# EasyEDA Pro project Generic_Robot_Controller_ver2.epro

# Board PCB2
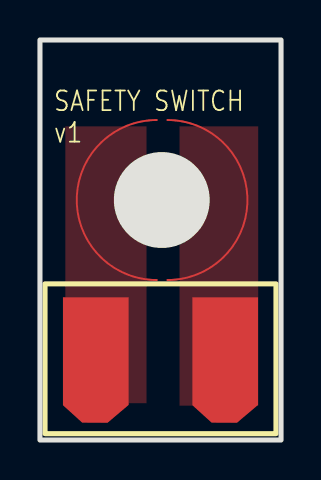
[diagram p0: board, top side]
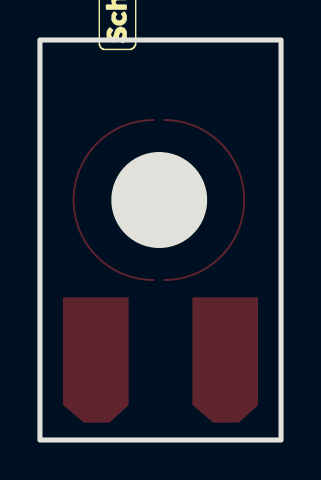
[diagram p1: board, bottom side, seen from below]

Outline 12.06 x 20 mm; copper layers: Top Layer, Bottom Layer. Coordinates in mm from the lower left corner of the outline.
Outline path: rectangle 0,20 12.06,0
Stack: Top Layer 0.035mm / Dielectric1 1.51mm FR4 er 4.5 / Bottom Layer 0.035mm

## Design rules (mm)
template: JLCPCB Capability(Two Layers Board)
spacing copperThickness1oz (default): track to track 0.102, other pairs 0.152 to 0.3
spacing copperThickness2oz: track to track 0.203, other pairs 0.152 to 0.3
track width copperThickness1oz (default): min 0.127, default 0.254, max 2.54
track width copperThickness2oz: min 0.203, default 0.254, max 2.54
differential pair differentialPair (default): width min 0.127, default 0.254, max 2.54; gap min 0.152, default 0.152
via viaSize (default): diameter min 0.5, default 0.61, max 10; hole min 0.3, default 0.305, max 6.3

## Placement (name value [footprint] x y rotation side)
U1  -  [Battery Solder Pad]  6.1 0.82 0 top
U2  -  [screw_switch]  6.1 12 0 top

## Footprints (pads in the part's own frame, mm; a bottom-side part is the same pattern mirrored in y, then rotated)
Battery Solder Pad
  custom 3.286x6.269 smd: 1(-3.302,3.175) 2(3.175,3.175)
screw_switch
  custom 4x8 smd: 1(-2.254,0) 2(2.286,0)

## Nets
$1N152: U1.1 U2.1
$1N166: U1.2 U2.2

## Copper pours and planes (outline as drawn; the poured copper is in the pictures)
$1N152 on Top Layer: 1.27,15.68 5.33,15.68 5.33,1.84 1.27,1.84
$1N166 on Top Layer: 6.99,15.68 10.92,15.68 10.92,1.71 6.99,1.71

## Text on the board
Top Silkscreen Layer: SAFETY SWITCH / v1

# Board PCB1_1
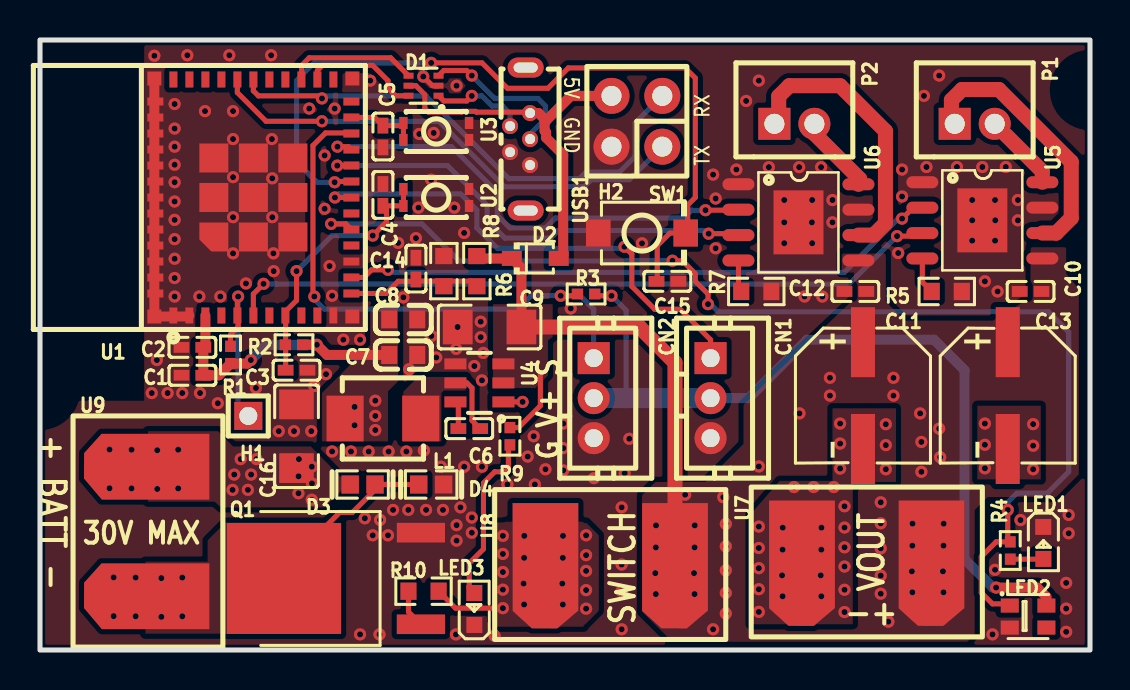
[diagram p2: board, top side]
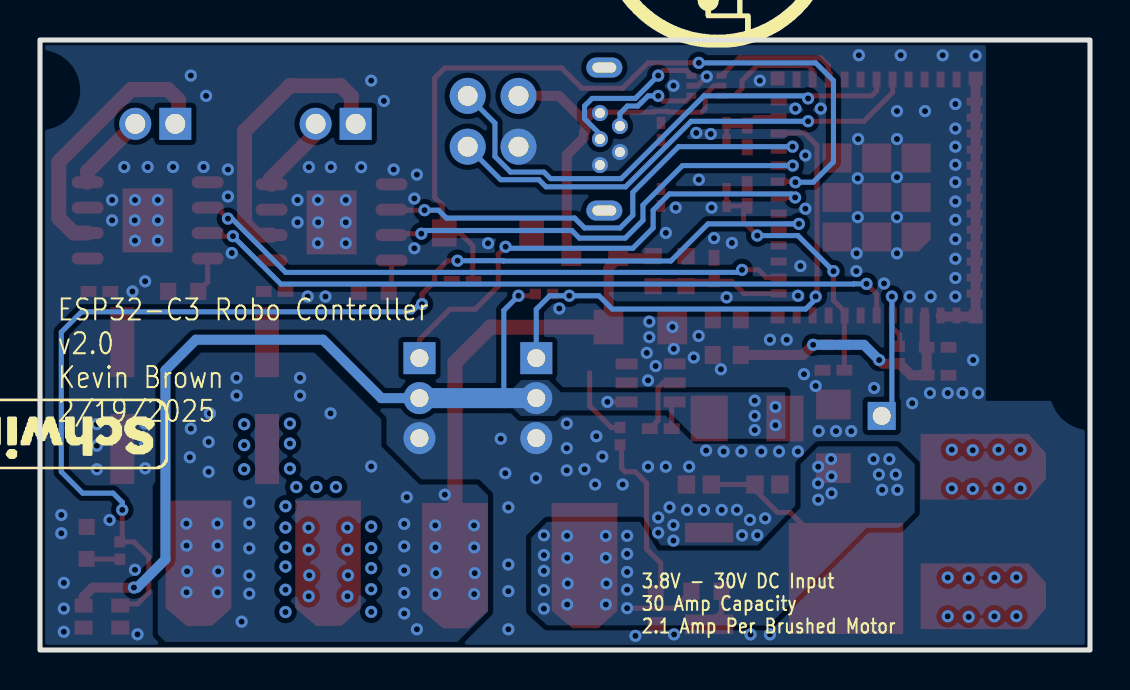
[diagram p3: board, bottom side, seen from below]

Outline 52.5 x 30.5 mm; copper layers: Top Layer, Inner1, Inner2, Bottom Layer. Coordinates in mm from the lower left corner of the outline.
Outline path: rectangle 0,30.5 52.5,0
Stack: Top Layer 0.035mm Outer layer thickness 1oz / Dielectric1 0.2104mm 7628 RC49% 8.6mil / Inner1 0.0152mm Inner layer thickness / Dielectric2 1.065mm 1.1mm H/HOZ Copper / Inner2 0.0152mm Inner layer thickness / Dielectric3 0.2104mm 7628 RC49% 8.6mil / Bottom Layer 0.035mm Outer layer thickness 1oz

## Design rules (mm)
template: Custom Config
spacing copperThickness1oz (default): track to track 0.102, other pairs 0.152 to 0.3
spacing copperThickness2oz: track to track 0.203, other pairs 0.152 to 0.3
track width copperThickness1oz (default): min 0.127, default 0.254, max 2.54
track width copperThickness2oz: min 0.203, default 0.254, max 2.54
differential pair differentialPair (default): width min 0.127, default 0.254, max 2.54; gap min 0.152, default 0.152
via viaSize (default): diameter min 0.5, default 0.61, max 10; hole min 0.3, default 0.305, max 6.3
net GND uses copperRegionDirect
net V_IN uses copperRegionDirect

## Placement (name value [footprint] x y rotation side)
C1  10uF  [C0402]  7.62 13.74 0 top
C2  100nF  [C0402]  7.62 15.13 0 top
C3  1uF  [C0402]  12.83 13.99 180 top
C4  100nF  [C0402]  17.15 22.75 270 top
C5  100nF  [C0402]  17.15 25.67 90 top
C6  100nF  [C0402]  21.46 11.07 180 top
C7  22uF  [C0603]  18.16 14.75 180 top
C8  22uF  [C0603]  18.16 16.53 180 top
C9  10uF  [C1206]  22.48 16.15 0 top
C10  100nF  [C0402]  49.53 17.93 0 top
C11  33uF  [CAP-SMD_BD6.3-L6.6-W6.6-FD]  41.15 12.72 270 top
C12  100nF  [C0402]  40.77 17.93 0 top
C13  33uF  [CAP-SMD_BD6.3-L6.6-W6.6-FD]  48.39 12.72 270 top
C14  47nF  [C0402]  18.8 19.07 270 top
C15  1uF  [C0402]  31.37 18.44 180 top
C16  10uF  [C1206]  12.83 10.69 270 top
CN1  SERVO1  [CONN-TH_3P-P2.00_PH-3AK]  33.53 12.59 270 top
CN2  SERVO2  [CONN-TH_3P-P2.00_PH-3AK]  27.69 12.59 270 top
D1  USBLC6-2P6_C2827693  [SOT-666-6_L1.6-W1.2-P0.50-LS1.6-BL]  19.18 28.21 90 top
D2  B5819WS_C22624  [SOD-323_L1.8-W1.3-LS2.5-RD]  24.76 19.58 0 top
D3  ESDA05  [D0603-BI]  16.13 8.28 180 top
D4  ESDA05  [D0603-BI]  19.56 8.28 180 top
H1  -  [HDR-TH_1P-V-M_XKB_X4611WV-01I-C28D40]  10.41 11.7 0 top
H2  -  [HDR-TH_4P-P2.54-V-F-R2-C2-S2.54]  29.84 26.44 90 top
L1  4.7uH  [IND-SMD_L4.5-W4.1_IHLP]  17.15 11.58 180 top
LED1  NCD0603B1  [LED0603-RD]  50.16 5.35 270 top
LED2  WS2812C-2020-V1  [LED-SMD_4P-L2.0-W2.0-TL_WS2812B-2020]  49.4 1.67 0 top
LED3  NCD0603G1  [LED0603-RD]  21.72 2.05 90 top
P1  MOTOR1  [CONN-TH_2P-P2.00_PH-2A_C2319]  46.74 26.31 180 top
P2  MOTOR2  [CONN-TH_2P-P2.00_PH-2A_C2319]  37.72 26.31 180 top
Q1  IRLR8726TRPBF  [TO-252-2_L6.6-W6.1-P4.58-LS9.9-TL]  15.62 3.58 180 top
R1  10kΩ  [R0402]  9.53 14.75 270 top
R2  10kΩ  [R0402]  12.7 15.26 0 top
R3  10kΩ  [R0402]  27.31 17.8 180 top
R4  1kΩ  [R0402]  48.51 4.97 90 top
R5  30kΩ  [R0603]  45.34 17.93 180 top
R6  27kΩ  [R0603]  21.84 18.94 90 top
R7  30kΩ  [R0603]  35.81 17.93 180 top
R8  3kΩ  [R0603]  20.19 18.94 270 top
R9  5.1kΩ  [R0402]  23.5 10.69 90 top
R10  10kΩ  [R0603]  19.18 2.94 180 top
SW1  TS-1088-AR02016  [SW-SMD_L3.9-W3.0-P4.45]  30.1 20.85 0 top
U1  2.4GHz  [WIFIM-SMD_ESP32-C3-MINI-1]  10.67 22.63 90 top
U2  RESET  [SW-SMD_4P-L3.0-W2.0-P0.85-LS3.5]  19.81 22.63 0 top
U3  BOOT  [SW-SMD_4P-L3.0-W2.0-P0.85-LS3.5]  19.81 25.93 0 top
U4  AP63203WU-7  [TSOT-26_L2.9-W1.6-P0.95-LS2.8-BL]  21.97 13.36 90 top
U5  DRV8871DDAR  [SO-8_L4.9-W3.9-P1.27-LS6.0-BL-EP]  47.12 21.48 270 top
U6  DRV8871DDAR  [SO-8_L4.9-W3.9-P1.27-LS6.0-BL-EP]  37.92 21.38 270 top
U7  -  [Battery Solder Pad]  41.4 1.16 0 top
U8  -  [Battery Solder Pad]  28.57 1.04 0 top
U9  -  [Battery Solder Pad]  2.16 5.86 270 top
USB1  MICRO 180°JB  [MINI-USB-SMD_U255-051N-4BH70-XS]  24 25.55 90 top

## Footprints (pads in the part's own frame, mm; a bottom-side part is the same pattern mirrored in y, then rotated)
Battery Solder Pad
  custom 3.286x6.269 smd: 1(-3.302,3.175) 2(3.175,3.175)
C0402
  rect 0.79x0.54 smd: 1(-0.545,0) 2(0.545,0)
C0603
  rect 0.8x0.9 smd: 1(-0.7,0) 2(0.7,0)
C1206
  rect 1.485x1.728 smd: 1(-1.593,0) 2(1.593,0)
CAP-SMD_BD6.3-L6.6-W6.6-FD
  rect 3.5x1.2 smd: 1(-2.67,0) 2(2.67,0)
CONN-TH_2P-P2.00_PH-2A_C2319
  rect 1.6x1.6 hole 1: 1(1,0)
  round 1.6 hole 1: 2(-1,0)
CONN-TH_3P-P2.00_PH-3AK
  rect 1.6x1.6 hole 0.9: 1(-2,0)
  round 1.6 hole 0.9: 2(0,0) 3(2,0)
D0603-BI
  rect 0.873x0.907 smd: 1(-0.622,0) 2(0.622,0)
HDR-TH_1P-V-M_XKB_X4611WV-01I-C28D40
  rect 1.4x1.4 hole 0.9: 1(0,0)
HDR-TH_4P-P2.54-V-F-R2-C2-S2.54
  round 1.8 hole 1: 1(-1.27,-1.27) 2(-1.27,1.27) 3(1.27,-1.27) 4(1.27,1.27)
IND-SMD_L4.5-W4.1_IHLP
  rect 1.855x2.286 smd: 1(-1.893,0) 2(1.893,0)
LED0603-RD
  rect 0.8x0.8 smd: 1(-0.799,-0.004) 2(0.799,0.004)
LED-SMD_4P-L2.0-W2.0-TL_WS2812B-2020
  rect 0.9x0.7 smd: 1(-0.915,0.55) 2(-0.915,-0.55) 3(0.915,-0.55) 4(0.915,0.55)
MINI-USB-SMD_U255-051N-4BH70-XS
  round 0.8 hole 0.5: 1(1.3,-0.5) 2(0.65,0.5) 3(0,-0.5) 4(-0.65,0.5) 5(-1.3,-0.5)
  oval 1x1.8 hole 0.5x1.2: 6(-3.575,-0.28) 6(3.575,-0.28)
R0402
  rect 0.566x0.54 smd: 1(-0.433,0) 2(0.433,0)
R0603
  rect 0.806x0.864 smd: 1(-0.753,0) 2(0.753,0)
SO-8_L4.9-W3.9-P1.27-LS6.0-BL-EP
  oval 0.6x1.6 smd: 1(-1.905,-3) 2(-0.635,-3) 3(0.635,-3) 4(1.905,-3) 5(1.905,3) 6(0.635,3) 7(-0.635,3) 8(-1.905,3)
  rect 3.2x2.5 smd: 9(0,0)
SOD-323_L1.8-W1.3-LS2.5-RD
  rect 1x0.75 smd: 1(-1.173,0) 2(1.173,0)
SOT-666-6_L1.6-W1.2-P0.50-LS1.6-BL
  rect 0.3x0.5 smd: 1(-0.5,-0.75) 2(-0.001,-0.75) 3(0.5,-0.75) 4(0.5,0.75) 5(0,0.75) 6(-0.5,0.75)
SW-SMD_4P-L3.0-W2.0-P0.85-LS3.5
  rect 0.42x0.6 smd: 1(-1.64,0.425) 1(-1.64,-0.425) 2(1.64,0.425) 2(1.64,-0.425)
SW-SMD_L3.9-W3.0-P4.45
  rect 1.23x1.36 smd: 1(-2.185,0) 2(2.185,0)
TO-252-2_L6.6-W6.1-P4.58-LS9.9-TL
  rect 2.409x0.979 smd: 1(-3.424,2.29) 3(-3.424,-2.29)
  rect 5.711x5.548 smd: 2(3.424,0)
TSOT-26_L2.9-W1.6-P0.95-LS2.8-BL
  rect 0.55x1.1 smd: 1(-0.95,-1.2) 2(0,-1.2) 3(0.95,-1.2) 4(0.95,1.2) 5(0,1.2) 6(-0.95,1.2)
WIFIM-SMD_ESP32-C3-MINI-1
  rect 0.8x0.4 smd: 1(-5.9,4) 2(-5.9,3.2) 3(-5.9,2.4) 4(-5.9,1.6) 5(-5.9,0.8) 6(-5.9,0) 7(-5.9,-0.8) 8(-5.9,-1.6) 9(-5.9,-2.4) 10(-5.9,-3.2) 11(-5.9,-4) 25(5.9,-4) 26(5.9,-3.2) 27(5.9,-2.4) 28(5.9,-1.6) 29(5.9,-0.8) 30(5.9,0) 31(5.9,0.8) 32(5.9,1.6) 33(5.9,2.4) 34(5.9,3.2) 35(5.9,4)
  rect 0.4x0.8 smd: 12(-4.8,-4.9) 13(-4,-4.9) 14(-3.2,-4.9) 15(-2.4,-4.9) 16(-1.6,-4.9) 17(-0.8,-4.9) 18(0,-4.9) 19(0.8,-4.9) 20(1.6,-4.9) 21(2.4,-4.9) 22(3.2,-4.9) 23(4,-4.9) 24(4.8,-4.9) 36(4.8,4.9) 37(4,4.9) 38(3.2,4.9) 39(2.4,4.9) 40(1.6,4.9) 41(0.8,4.9) 42(0,4.9) 43(-0.8,4.9) 44(-1.6,4.9) 45(-2.4,4.9) 46(-3.2,4.9) 47(-4,4.9) 48(-4.8,4.9)
  custom 1.45x1.45 smd: 49(-1.975,1.975)
  rect 1.45x1.45 smd: 49(-1.975,0) 49(-1.975,-1.975) 49(0,1.975) 49(0,0) 49(0,-1.975) 49(1.975,1.975) 49(1.975,0) 49(1.975,-1.975)
  rect 0.7x0.7 smd: 50(5.95,4.95) 51(5.95,-4.95) 52(-5.95,-4.95) 53(-5.95,4.95)

## Nets
3V3: C1.2 C2.2 C7.2 C8.2 CN1.2 CN2.2 L1.2 LED2.4 R1.2 R2.2 R3.1 U1.3 U4.1
GND: C1.1 C2.1 C3.1 C4.1 C5.1 C7.1 C8.1 C9.1 C10.1 C11.2 C12.1 C13.2 C14.1 C15.1 C16.1 CN1.3 CN2.3 D1.2 D4.1 H2.2 LED1.1 LED2.2 LED3.1 Q1.3 R5.1 R7.1 R8.1 SW1.1 U1.1 U1.2 U1.11 U1.14 U1.36 U1.37 U1.38 U1.39 U1.40 U1.41 U1.42 U1.43 U1.44 U1.45 U1.46 U1.47 U1.48 U1.49 U1.50 U1.51 U1.52 U1.53 U2.2 U3.2 U4.4 U5.1 U5.7 U5.9 U6.1 U6.7 U6.9 U7.1 USB1.4 USB1.5
BATT_GND: D3.1 D4.2 Q1.2 U9.2
BATT_IN: C16.2 D3.2 R10.1 U8.1 U9.1
BATT_MEAS: C14.2 R6.1 R8.2 U1.12
BOOT: C5.2 U1.23 U3.1
DEBUG_LED: LED2.1 R4.2 U1.16
DN: D1.6 U1.26
DN_IN: D1.1 USB1.2
DP: D1.4 U1.27
DP_IN: D1.3 USB1.3
MODE_BUTTON: C15.2 SW1.2 U1.19
MOTOR1_IN1: U1.6 U5.3
MOTOR1_IN2: U1.13 U5.2
MOTOR1_OUT1: P1.1 U5.6
MOTOR1_OUT2: P1.2 U5.8
MOTOR2_IN1: U1.20 U6.3
MOTOR2_IN2: U1.21 U6.2
MOTOR2_OUT1: P2.1 U6.6
MOTOR2_OUT2: P2.2 U6.8
RESET: C3.2 C4.2 R2.1 U1.8 U2.1
RX: H2.3 U1.30
SERVO1: CN1.1 U1.18
SERVO2: CN2.1 R3.2 U1.22
TX: H2.1 U1.31
USB_VIN: D1.5 D2.2 H2.4 USB1.1
V_IN: C9.2 C10.2 C11.1 C12.2 C13.1 D2.1 R6.2 R9.2 U4.2 U4.3 U5.5 U6.5 U7.2 U8.2
$2N3486: H1.1 R1.1 U1.5
$2N6315: LED1.2 R4.1
$3N14077: R5.2 U5.4
$3N14707: R7.2 U6.4
$3N15851: C6.1 L1.1 U4.5
$3N15857: C6.2 U4.6
$5N508: Q1.1 R10.2
$5N1481: LED3.2 R9.1

Pads without a net: LED2 3; U1 4 7 9 10 15 17 24 25 28 29 32 33 34 35; USB1 6

## Via types
v1: diameter 0.61, hole 0.305, Top Layer to Bottom Layer, 316 vias

## Routing (per net, layer and track width the routed paths; a pad name or vN(x,y) marks a point on that pad's centre or on a via; arc(x,y) is an arc through that point)
3V3: length 56.2
  Top Layer w0.254: U4.1 v1(24.13,12.41) ; R3.1 27.83,17.71 v1(28.57,17.71)
  Top Layer w0.5: v1(10.54,14.5) 10.36,14.32 9.53,14.32 8.94,13.74 C1.2 C2.2 8.27,15.24 U1.3 ; v1(47.8,3.12) 49.86,3.12 50.32,2.66 LED2.4 ; C7.2 14.35,14.75 13.84,15.26 13.26,15.26
  Bottom Layer w0.254: 29.31,12.59 29.31,16.98 v1(28.57,17.71)
  Bottom Layer w0.5: v1(47.8,3.12) 47.64,3.12 46.23,4.53 46.23,13.99 44.7,15.51 38.35,15.51 35.43,12.59 CN1.2 ; v1(10.54,14.5) 11.3,15.26 v1(13.84,15.26)
  Bottom Layer w1: CN1.2 CN2.2
  vias: v1(15.73,12.16) v1(15.73,11.24) v1(16.76,12.47) v1(16.76,11.7) v1(16.76,11)
GND: length 14.6
  Top Layer w0.254: D1.2 19.62,28.21 v1(19.16,28.67)
  Top Layer w0.5: U1.50 U1.53 7.42,16.68 U1.2
  vias: v1(5.59,12.85) v1(5.72,29.71) v1(5.84,14.5) v1(6.38,12.85) v1(6.73,27.3) v1(6.73,26.07) v1(6.73,25.17) v1(6.73,24.26) v1(6.73,23.39) v1(6.73,22.43) v1(6.73,21.51) v1(6.73,20.54) v1(6.73,19.56) v1(6.73,18.6) v1(6.73,17.67) v1(7.11,12.85) v1(7.37,29.74) v1(7.97,17.68) v1(8,12.85) v1(8.25,26.94) v1(8.89,12.34) v1(9.02,17.67) v1(9.46,29.74) v1(9.65,26.94) v1(9.65,25.55) v1(9.65,23.64) v1(9.65,21.64) v1(9.65,19.83) v1(10.3,18.33) v1(10.79,13.1) v1(11.56,29.74) v1(11.59,25.55) v1(11.61,23.58) v1(11.61,21.64) v1(11.67,19.83) v1(11.68,18.94) v1(11.94,10.94) v1(12.7,10.94) v1(13.46,27.07) v1(13.56,10.94) v1(13.72,13.2) v1(14.23,24.73) v1(14.23,22.06) v1(14.3,13.79) v1(14.48,19.2) v1(14.6,17.71) v1(14.6,9.93) v1(14.73,27.07) v1(15.16,15.51) v1(15.55,9.93) v1(16,15.51) v1(16,0.78) v1(16.24,6.58) v1(16.44,9.93) v1(16.51,28.47) v1(16.64,5.73) v1(17,6.51) v1(16.97,0.78) v1(17.43,9.93) v1(17.4,5.73) v1(17.65,7) v1(17.91,20.35) v1(18.17,17.63) v1(18.32,9.93) v1(18.41,7) v1(18.46,14.04) v1(18.8,20.59) v1(18.92,22.12) v1(18.96,25.8) v1(19.19,9.97) v1(19.3,7) v1(19.56,23.52) v1(19.57,15.7) v1(19.69,25.85) v1(19.81,14.62) v1(20.04,9.16) v1(20.15,7) v1(20.71,22.12) v1(20.83,28.21) v1(20.81,15.06) v1(20.83,6.24) v1(20.83,5.47) v1(20.8,0.78) v1(20.88,16.15) v1(21.02,7.13) v1(21.21,20.85) v1(21.21,9.16) v1(21.59,6.62) v1(21.59,5.86) v1(21.72,14.2) v1(22.03,16.42) v1(22.03,15.64) v1(22.1,13.48) v1(22.1,9.16) v1(22.16,14.86) v1(22.73,0.71) v1(23.37,8.28) v1(24.38,9.67) v1(24.69,10.69) v1(24.74,8.28) v1(25.27,9.04) v1(26.16,11.32) v1(26.16,10.09) v1(26.16,8.98) v1(26.54,17.08) v1(27.7,8.59) v1(29.08,7.13) v1(29.08,4.27) v1(29.08,2.94) v1(29.08,1.04) v1(29.24,8.84) v1(29.46,10.56) v1(30.1,20.34) v1(33.66,23.77) v1(33.78,22.58) v1(33.78,20.09) v1(34.82,24.02) v1(35.31,27.45) v1(35.94,28.47) v1(35.94,6.17) v1(35.94,5.1) v1(35.94,4.09) v1(35.94,3.04) v1(35.94,1.91) v1(36.44,24.14) v1(37.14,6.12) v1(37.13,5.02) v1(37.1,3.73) v1(37.13,2.69) v1(37.21,22.5) v1(37.21,21.38) v1(37.21,20.34) v1(37.7,8.15) v1(37.96,24.14) v1(38.23,17.67) v1(38.61,22.5) v1(38.59,21.38) v1(38.61,20.34) v1(38.68,8.15) v1(39.04,3.73) v1(39.06,24.14) v1(39.12,17.67) v1(39.07,6.12) v1(39.07,5.02) v1(39.07,2.69) v1(39.62,22.5) v1(39.62,21.38) v1(39.69,8.15) v1(40,11.32) v1(40,10.32) v1(40,9.07) v1(40.23,7.19) v1(40.23,6.12) v1(40.23,5.13) v1(40.23,4.17) v1(40.23,3.01) v1(40.23,1.9) v1(42.29,11.29) v1(42.29,10.24) v1(42.29,9.04) v1(42.91,19.85) v1(43.1,24.02) v1(43.1,22.67) v1(44.2,27.71) v1(44.32,24.15) v1(44.96,28.72) v1(45.85,24.15) v1(46.61,22.5) v1(46.61,21.48) v1(46.61,20.47) v1(47.12,24.15) v1(47.24,18.44) v1(47.24,11.32) v1(47.24,10.26) v1(47.24,9.08) v1(47.62,0.78) v1(47.75,22.5) v1(47.76,21.48) v1(47.75,20.47) v1(47.75,4.01) v1(47.88,17.93) v1(48.29,24.15) v1(48.9,22.5) v1(48.9,21.48) v1(49.02,6.5) v1(49.66,11.29) v1(49.66,10.22) v1(49.66,9.04) v1(51.31,3.36) v1(51.31,2.07) v1(51.31,0.91) v1(51.44,6.75) v1(51.44,5.83)
BATT_GND: length 9.1
  Top Layer w0.254: Q1.2 12.2,4.09 14.99,6.88 15.62,6.88 16.75,8.01 D3.1 D4.2
  vias: v1(3.68,3.63) v1(3.68,1.69) v1(4.78,3.62) v1(4.78,1.69) v1(6.07,3.59) v1(6.07,1.66) v1(7.11,3.62) v1(7.11,1.69)
BATT_IN: length 3.6
  Top Layer w0.254: R10.1 20.78,2.09 v1(23.14,2.09)
  vias: v1(3.48,10.02) v1(3.48,8.09) v1(4.58,10.02) v1(4.58,8.08) v1(5.86,9.99) v1(5.86,8.05) v1(6.91,10.02) v1(6.91,8.08) v1(9.63,8.01) v1(9.71,8.77) v1(10.03,9.55) v1(10.39,8.01) v1(10.55,8.77) v1(10.83,9.55) v1(12.95,9.55) v1(12.93,8.68) v1(12.92,7.84) v1(13.59,9.16) v1(13.6,8.33) v1(13.59,7.51) v1(23.14,5.71) v1(23.14,4.8) v1(23.14,3.9) v1(23.14,3.02) v1(24.21,5.71) v1(24.21,4.61) v1(24.18,3.32) v1(24.21,2.27) v1(26.15,5.71) v1(26.14,4.61) v1(26.11,3.32) v1(26.14,2.27) v1(27.31,5.73) v1(27.31,4.74) v1(27.31,3.95) v1(27.31,2.99) v1(27.31,2.07)
BATT_MEAS: length 6.7
  Top Layer w0.254: R6.1 21.59,18.44 18.88,18.44 C14.2 18.71,18.44 17.91,18.44 17.3,17.83 U1.12
BOOT: length 3.7
  Top Layer w0.254: U3.1 U3.1 18.04,26.22 C5.2 16.74,26.63 U1.23
DEBUG_LED: length 58.7
  Top Layer w0.254: v1(48.39,7) 48.39,5.53 R4.2 47.8,5.41 47.06,4.67 47.06,2.87 47.62,2.31 48.4,2.31 LED2.1 ; U1.16 15.29,21.31 v1(14.55,21.31) ; v1(33.4,17.29) 33.4,17.8 32.77,18.44 32.77,18.82 32.12,19.46 v1(31.62,19.46)
  Bottom Layer w0.254: v1(14.55,21.31) 19.1,21.31 20.96,19.45 29.34,19.45 29.35,19.46 v1(31.62,19.46) ; v1(33.4,17.29) 33.53,17.29 33.91,16.91 50.42,16.91 51.44,15.89 51.44,8.91 50.37,7.84 48.84,7.84 48.39,7.39 v1(48.39,7)
DN: length 6
  Top Layer w0.254: U1.26 13.87,28.98 14.12,29.23 16.64,29.23 17.4,28.47 17.4,28.09 17.77,27.71 D1.6
DN_IN: length 4.8
  Top Layer w0.254: D1.1 20.19,27.45 21.34,27.45 v1(21.59,27.71)
  Bottom Layer w0.254: v1(21.59,27.71) 22.1,27.71 22.43,27.38 22.43,27.38 22.61,27.2 23.13,27.2 23.5,26.83 USB1.2
DP: length 6.6
  Top Layer w0.254: D1.4 17.53,29.61 13.46,29.61 13.08,29.23 13.08,28.54 U1.27
DP_IN: length 8.2
  Top Layer w0.254: D1.3 20.19,28.98 21.34,28.98 v1(21.59,28.72)
  Bottom Layer w0.254: v1(21.59,28.72) 22.73,27.58 24.89,27.58 25.27,27.2 25.27,26.56 24.5,25.79 USB1.3
MODE_BUTTON: length 40.1
  Top Layer w0.254: v1(19.56,29.36) 22.1,29.36 23.37,28.09 25.4,28.09 26.42,29.1 32.26,29.1 32.77,28.59 32.77,22.63 32.38,22.25 32.38,20.95 SW1.2 31.5,20.85 30.86,20.21 30.86,18.47 C15.2 ; U1.19 14.77,23.43 v1(14.73,23.39)
  Bottom Layer w0.254: v1(14.73,23.39) 13.84,23.39 12.83,24.4 12.83,28.47 13.72,29.36 v1(19.56,29.36)
MOTOR1_IN1: length 36.2
  Top Layer w0.254: v1(11.18,18.31) 10.67,17.8 U1.6 ; v1(42.85,20.69) 44.34,20.69 44.5,20.85
  Bottom Layer w0.254: v1(42.85,20.69) 40.46,18.3 11.82,18.3 11.81,18.31 v1(11.18,18.31)
MOTOR1_IN2: length 30.5
  Top Layer w0.254: U1.13 16.19,18.63 16.57,19.01 v1(17.4,19.01) ; 44.5,22.12 43.65,22.12 v1(43.1,21.57)
  Bottom Layer w0.254: v1(17.4,19.01) 17.53,18.88 40.21,18.88 42.85,21.52 43.05,21.52 v1(43.1,21.57)
MOTOR1_OUT1: length 13.5
  Top Layer w0.75: P1.1 45.57,26.47 45.57,27.49 46.1,28.02 47.94,28.02 51.56,24.4 51.56,21.6 50.81,20.85 U5.6
MOTOR1_OUT2: length 3.9
  Top Layer w0.75: P1.2 50.12,23.93 U5.8
MOTOR2_IN1: length 23
  Top Layer w0.254: v1(33.43,20.82) 34.85,20.82 U6.3 ; v1(14.86,24.22) 15.56,24.22 U1.20
  Bottom Layer w0.254: v1(14.86,24.22) 20.38,24.22 22.35,22.25 22.35,21.48 23.24,20.59 25.53,20.59 25.91,20.97 33.27,20.97 v1(33.43,20.82)
MOTOR2_IN2: length 23.5
  Top Layer w0.254: v1(33.27,21.99) 34.9,21.99 U6.2 ; U1.21 15.43,25.17 v1(14.87,25.17)
  Bottom Layer w0.254: v1(33.27,21.99) 32.57,21.99 32.18,21.6 25.77,21.6 25.27,21.1 23.5,21.1 22.86,21.74 22.86,22.88 20.57,25.17 v1(14.87,25.17)
MOTOR2_OUT1: length 14.2
  Top Layer w0.75: P2.1 36.93,26.52 36.93,27.68 37.47,28.21 40,28.21 42.27,25.95 42.27,21.33 41.68,20.75 U6.6
MOTOR2_OUT2: length 4
  Top Layer w0.65: 38.75,26.28 P2.2
  Top Layer w0.75: U6.8 40.99,23.35 40.99,23.55 38.75,25.79 38.75,26.28
RESET: length 13.6
  Top Layer w0.254: U2.1 18.17,22.2 18.16,22.21 C4.2 17.32,22.03 17.32,21.41 v1(16.64,20.72) ; v1(12.83,18.94) 12.83,17.48 12.27,16.92 U1.8 12.28,16.71 12.28,13.86
  Bottom Layer w0.254: v1(16.64,20.72) 14.6,20.72 v1(12.83,18.94)
RX: length 25.6
  Top Layer w0.254: U1.30 10.67,27.96 10.92,27.71 13.97,27.71 v1(14.1,27.58)
  Bottom Layer w0.254: H2.3 29.75,26.34 29.75,24.68 28.97,23.9 27.31,23.9 26.98,23.57 23.44,23.57 19.3,27.71 14.22,27.71 v1(14.1,27.58)
SERVO1: length 25.1
  Top Layer w0.254: v1(29.22,20.16) 29.59,19.79 29.59,18.18 30.73,17.04 32,17.04 33.53,15.51 CN1.1 ; U1.18 v1(14.75,22.63)
  Bottom Layer w0.254: v1(29.22,20.16) 29.14,20.09 22.86,20.09 21.84,21.1 21.84,21.99 21.03,22.8 14.92,22.8 v1(14.75,22.63)
SERVO2: length 27.9
  Top Layer w0.254: R3.2 26.78,17.71 v1(26.03,17.71) ; v1(13.72,17.67) 13.65,17.74 13.65,25.22 14.28,25.85 15.54,25.85 U1.22
  Bottom Layer w0.254: CN2.1 27.69,17.04 27.01,17.71 v1(26.03,17.71) 24.55,17.71 23.89,17.05 14.21,17.05 13.72,17.55 v1(13.72,17.67)
TX: length 24.7
  Top Layer w0.254: U1.31 9.87,27.87 11.3,26.44 v1(14.1,26.44)
  Bottom Layer w0.254: H2.1 29.46,23.52 27.55,23.52 27.2,23.16 23.22,23.16 19.94,26.44 v1(14.1,26.44)
USB_VIN: length 19.2
  Top Layer w0.254: D1.5 18.8,28.21 19.24,27.77 19.24,27.07 19.42,26.89 21.09,26.89 21.13,26.93 21.78,26.93 21.82,26.89 24.46,26.89
  Top Layer w0.5: 25.31,26.47 25.23,26.39 25.23,25.95 25.31,25.88 25.31,25.61 26.16,24.76 26.16,19.8 D2.2 ; 25.31,26.47 24.93,26.85 USB1.1 ; 25.31,26.47 26.54,27.71 H2.4
V_IN: length 27.6
  Top Layer w0.254: 23.5,11.12 23.93,11.12 25.02,12.21 25.02,13.86
  Top Layer w0.5: R6.2 21.96,19.58 D2.1 24.07,19.1 C9.2
  Top Layer w0.75: U8.2 31.75,14.37 29.97,16.15 C9.2
  vias: v1(30.8,6.23) v1(30.79,5.13) v1(30.76,3.84) v1(30.79,2.8) v1(32.26,7.77) v1(32.74,6.23) v1(32.73,5.13) v1(32.7,3.84) v1(32.73,2.8) v1(33.66,1.04) v1(34.16,7.64) v1(34.29,6.31) v1(34.29,5.18) v1(34.29,3.98) v1(34.29,2.85) v1(34.29,1.83) v1(35.94,9.18) v1(37.97,11.83) v1(39.5,13.61) v1(39.5,12.72) v1(42.04,7.39) v1(42.04,6.33) v1(42.04,5.08) v1(42.04,3.72) v1(42.04,2.81) v1(42.42,1.42) v1(42.67,13.61) v1(42.67,12.72) v1(43.63,6.32) v1(43.62,5.22) v1(43.59,3.93) v1(43.62,2.89) v1(44.01,11.83) v1(44.07,10.4) v1(44.07,8.91) v1(44.96,11.07) v1(45.01,9.64) v1(45.15,3.93) v1(45.18,6.32) v1(45.17,5.22) v1(45.17,2.89)
$2N3486: length 8.9
  Top Layer w0.254: v1(9.91,17.67) 9.87,17.64 U1.5 9.91,16.69 9.91,16.15 9.53,15.77 R1.1
  Bottom Layer w0.254: v1(9.91,17.67) 9.91,12.21 H1.1
$2N6315: length 1.7
  Top Layer w0.254: R4.1 50.15,4.54 LED1.2
$3N14077: length 1.8
  Top Layer w0.254: U5.4 44.12,18.4 R5.2
$3N14707: length 1.6
  Top Layer w0.254: U6.4 34.92,18.07 R7.2
$3N15851: length 3.1
  Top Layer w0.254: C6.1 21.6,11.48 21.6,13.1 21.35,13.36 U4.5
$3N15857: length 1.4
  Top Layer w0.254: C6.2 20.92,12.26 U4.6
$5N508: length 1.9
  Top Layer w0.254: R10.2 18.42,1.91 19.04,1.29
$5N1481: length 8.6
  Top Layer w0.254: R9.1 23.42,10.18 23.42,9.09 23.24,8.91 22.73,8.91 22.17,8.35 22.17,5.05 21.46,4.34 21.46,3.1 LED3.2

## Copper pours and planes (outline as drawn; the poured copper is in the pictures)
3V3 on Top Layer: 14.1,17.15 17.9,17.15 17.9,10.43 14.1,10.43
3V3 on Bottom Layer: 15.24,13.5 28.83,13.5 28.83,10.56 15.24,10.56
GND on Top Layer: 46.86,12.21 50.04,12.21 50.04,8.53 46.86,8.53
GND on Top Layer: 35.54,8.46 40.64,8.46 40.64,1.29 35.54,1.29
GND on Top Layer: 7.49,25.93 13.08,25.93 13.08,19.58 7.49,19.58
GND on Top Layer: 39.62,12.08 42.8,12.08 42.8,8.4 39.62,8.4
GND on Top Layer: -4.57,34.44 54.86,34.44 54.86,-2.27 -4.57,-2.27
GND on Bottom Layer: -4.95,33.67 57.02,33.67 57.02,-2.65 -4.95,-2.65
GND on Inner1: -5.59,32.79 58.04,32.79 58.04,-3.16 -5.59,-3.16
GND on Inner2: -4.57,32.41 55.63,32.41 55.63,-2.14 -4.57,-2.14
BATT_GND on Top Layer: 5.27,6.37 14.86,6.37 14.86,0.82 5.27,0.82
BATT_IN on Top Layer: 22.61,6.37 27.31,6.37 27.94,5.73 27.94,1.97 27.26,1.29 22.73,1.29 22.61,1.42
BATT_IN on Top Layer: 22.76,6.41 27.84,6.41 27.84,1.16 22.76,1.16
BATT_IN on Top Layer: 5.4,10.94 15.37,10.94 15.37,7.13 5.4,7.13
BATT_IN on Bottom Layer: 8.76,10.18 27.94,10.18 27.94,1.24 8.76,1.24
BATT_IN on Inner1: 8.76,10.18 27.94,10.18 27.94,1.24 8.76,1.24
BATT_IN on Inner2: 8.76,10.18 27.94,10.18 27.94,1.24 8.76,1.24
V_IN on Top Layer: 30.1,1.92 31.62,0.41 46.35,0.41 46.74,0.79 46.74,7 47.38,7.65 50.81,7.65 51.94,8.78 51.94,18.05 51.31,18.82 51.31,20.14 49.53,20.14 49.53,17.63 47.65,16.47 43.24,16.47 42.29,17.42 42.29,19.83 40.09,19.83 40.09,18.88 40.69,18.88 40.69,17.54 36.43,13.51 35.18,12.26 35.18,10.31 33.27,8.4 30.77,8.4 30.1,7.73
V_IN on Top Layer: 22.65,17.29 25.63,17.29 25.63,13.1 22.65,13.1
V_IN on Bottom Layer: 30.1,7.73 30.1,1.92 31.63,0.4 46.23,0.4 46.61,0.78 46.61,8.15 45.72,9.04 45.72,13.61 44.45,14.88 38.79,14.88 35.43,11.52 35.43,10.18 33.53,8.28 30.64,8.28
$3N15851 on Top Layer: 18.17,13.65 21.29,13.65 21.29,10.43 18.17,10.43

## Text on the board
Bottom Silkscreen Layer: 3.8V - 30V DC Input / 30 Amp Capacity / 2.1 Amp Per Brushed Motor | ESP32-C3 Robo Controller / v2.0 / Kevin Brown / 2/19/2025
Top Silkscreen Layer: TX   RX | 5V  GND | G V+ S | 30V MAX | SWITCH | VOUT | + BATT - | -+
